# EAGLE design oak-rgb-driver-board (EAGLE 7.3.0)
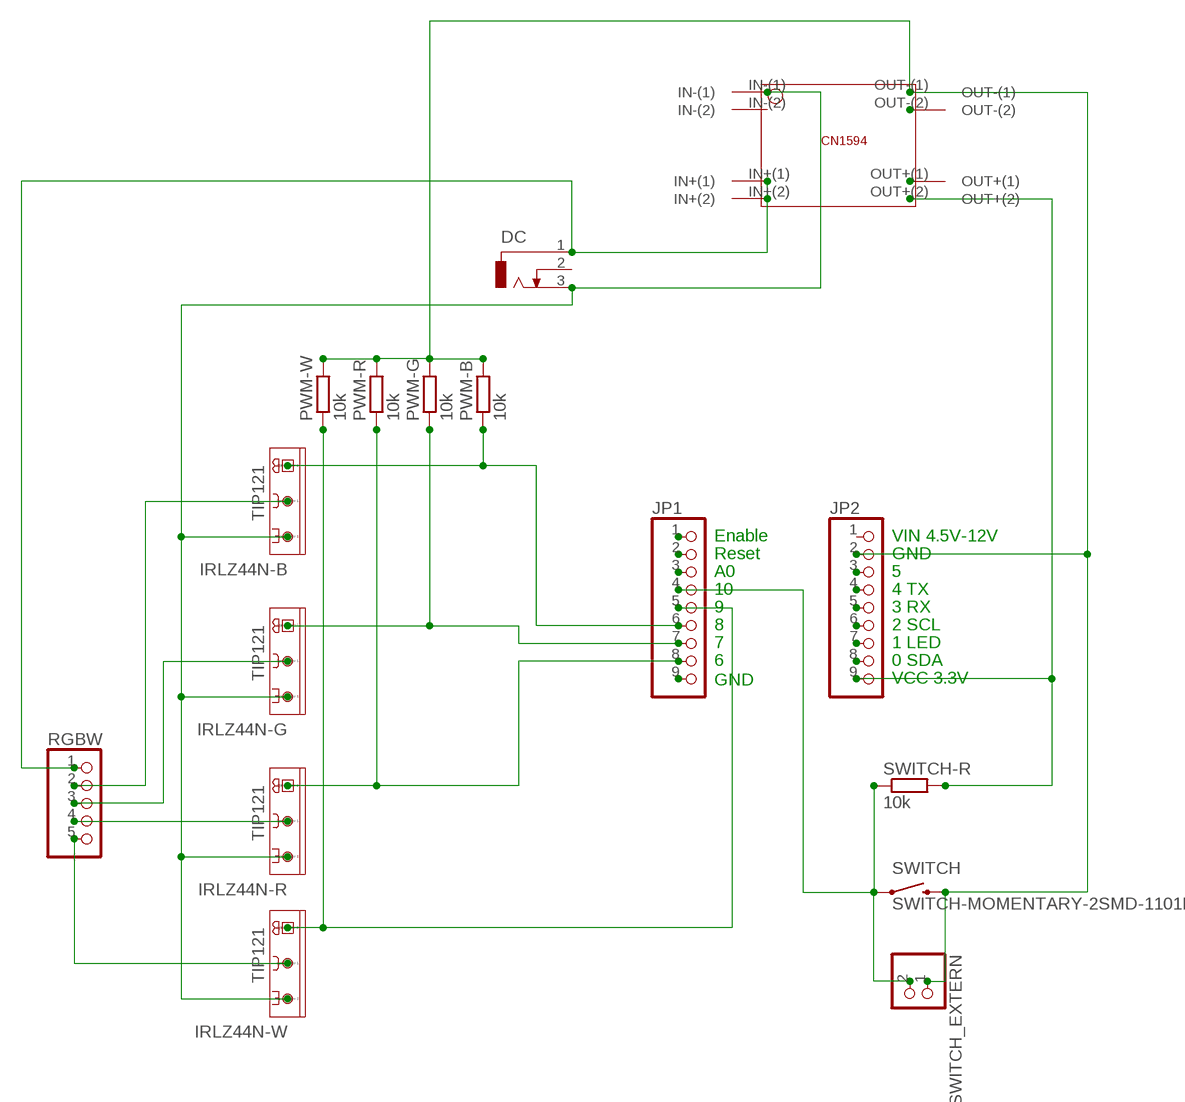
[diagram p0: schematic, sheet 1]

## Parts
DC  DCJ0202  [DCJ0202]
IRLZ44N-B  TIP121  [TO220AV]
IRLZ44N-G  TIP121  [TO220AV]
IRLZ44N-R  TIP121  [TO220AV]
IRLZ44N-W  TIP121  [TO220AV]
JP1  PINHD-1X9  [1X09]
JP2  PINHD-1X9  [1X09]
PWM-B  10k  R-EU_R0603  [R0603]
PWM-G  10k  R-EU_R0603  [R0603]
PWM-R  10k  R-EU_R0603  [R0603]
PWM-W  10k  R-EU_R0603  [R0603]
RGBW  PINHD-1X5  [1X05]
SWITCH  SWITCH-MOMENTARY-2SMD-1101NE  [TACTILE-SWITCH-1101NE]
SWITCH-R  10k  R-EU_R0603  [R0603]
SWITCH_EXTERN  PINHD-1X2  [1X02]
U$1  CN1594THROUGH-HOLE  [CN1594]

## Nets
B_DRIVE [12V]: IRLZ44N-B.C RGBW.2
G_DRIVE [12V]: IRLZ44N-G.C RGBW.3
GND [GND3.3]: JP2.2 PWM-B.2 PWM-G.2 PWM-R.2 PWM-W.2 SWITCH.2 SWITCH_EXTERN.1 U$1.OUT-(1)
GND_IN [GNDRGB]: DC.3 IRLZ44N-B.E IRLZ44N-G.E IRLZ44N-R.E IRLZ44N-W.E U$1.IN-(1)
N$3: JP1.9
N$7: U$1.OUT+(1)
N$9: U$1.OUT-(2)
N$12: JP1.3
N$16: JP1.2
N$17: JP1.1
N$19: JP2.8
N$20: JP2.7
N$21: JP2.6
N$22: JP2.5
N$23: JP2.4
N$24: JP2.3
P6_OUT [Signal]: IRLZ44N-R.B JP1.8 PWM-R.1
P7_OUT [Signal]: IRLZ44N-G.B JP1.7 PWM-G.1
P8_OUT [Signal]: IRLZ44N-B.B JP1.6 PWM-B.1
P9_OUT [Signal]: IRLZ44N-W.B JP1.5 PWM-W.1
P10_IN [Signal]: JP1.4 SWITCH-R.1 SWITCH.1 SWITCH_EXTERN.2
R_DRIVE [12V]: IRLZ44N-R.C RGBW.4
VCC_DC [12V]: DC.1 RGBW.1 U$1.IN+(1) U$1.IN+(2)
VCC_LOW [3.3V]: JP2.9 SWITCH-R.2 U$1.OUT+(2)
W_DRIVE [12V]: IRLZ44N-W.C RGBW.5
Unconnected: DC.2 JP2.1 U$1.IN-(2)

## Notes on the sheet
- Enable | VIN 4.5V-12V
- Reset | GND
- A0 | 5
- 10 | 4 TX
- 9 | 3 RX
- 8 | 2 SCL
- 7 | 1 LED
- 6 | 0 SDA
- GND | VCC 3.3V

## Library data of the parts
DC = con-jack:DCJ0202: DC POWER JACK Source: DCJ0202.pdf; OC_FARNELL: unknown; OC_NEWARK: unknown
IRLZ44N-B IRLZ44N-G IRLZ44N-R IRLZ44N-W = PAsystem:TIP121: TO-220
JP1 JP2 = pinhead:PINHD-1X9: PIN HEADER
PWM-B PWM-G PWM-R PWM-W SWITCH-R = rcl:R-EU_: RESISTOR, European symbol
RGBW = pinhead:PINHD-1X5: PIN HEADER
SWITCH = SparkFun-Electromechanical:SWITCH-MOMENTARY-2: Various NO switches- pushbuttons, reed, etc; PROD_ID: SWCH-00815
SWITCH_EXTERN = pinhead:PINHD-1X2: PIN HEADER
U$1 = CN1594_smd:CN1594

## Net classes
1 GNDRGB: width 1.27 mm
2 12V: width 1.27 mm
3 GND3.3: width 0.635 mm
4 Signal: width 0.381 mm
5 3.3V: width 0.635 mm

## Board
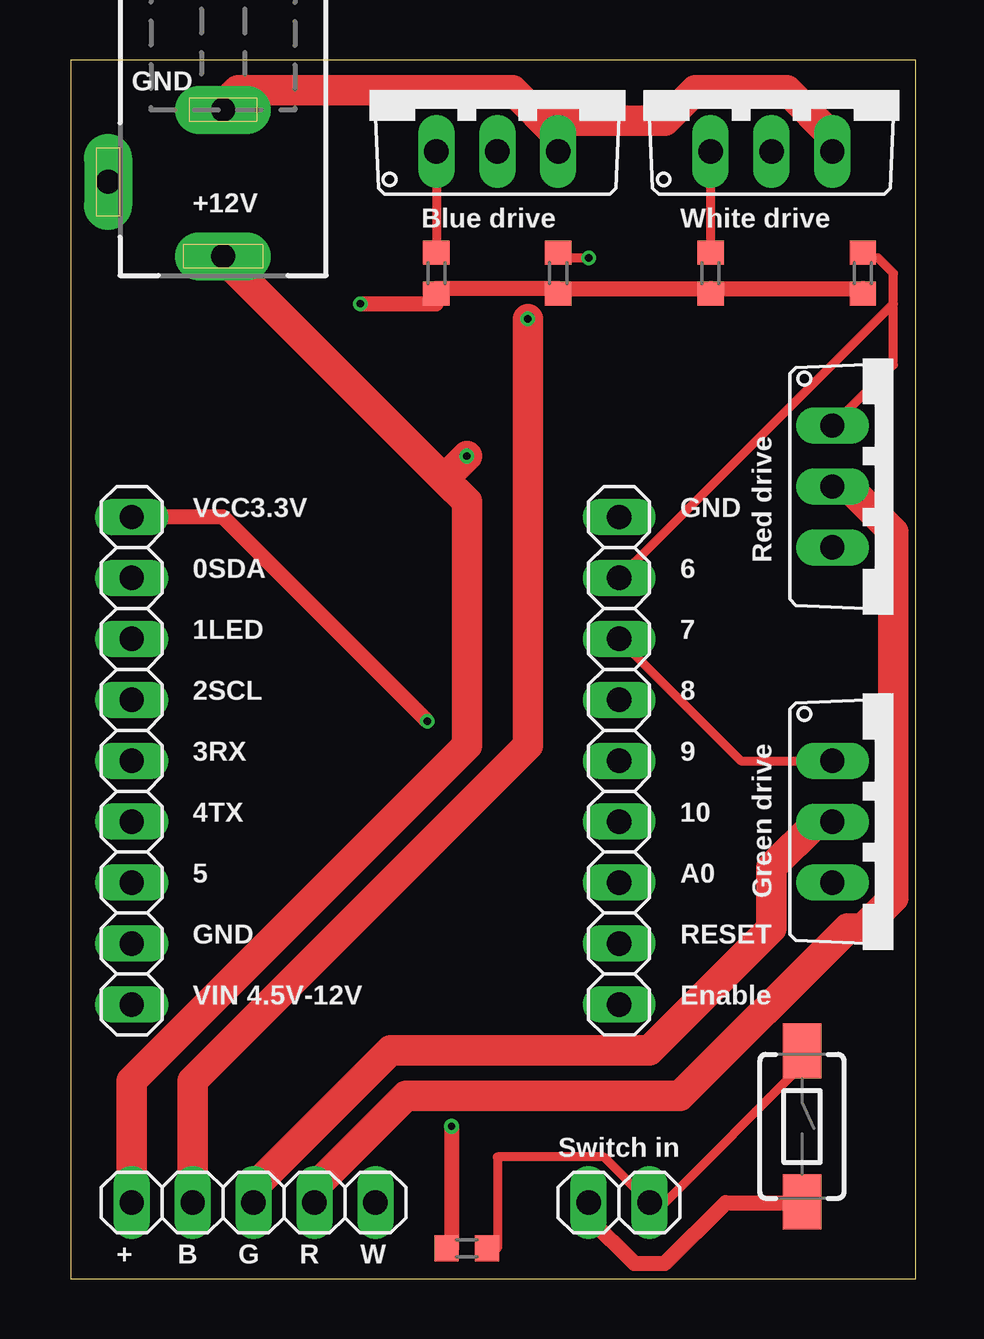
[diagram p1: board, top side]
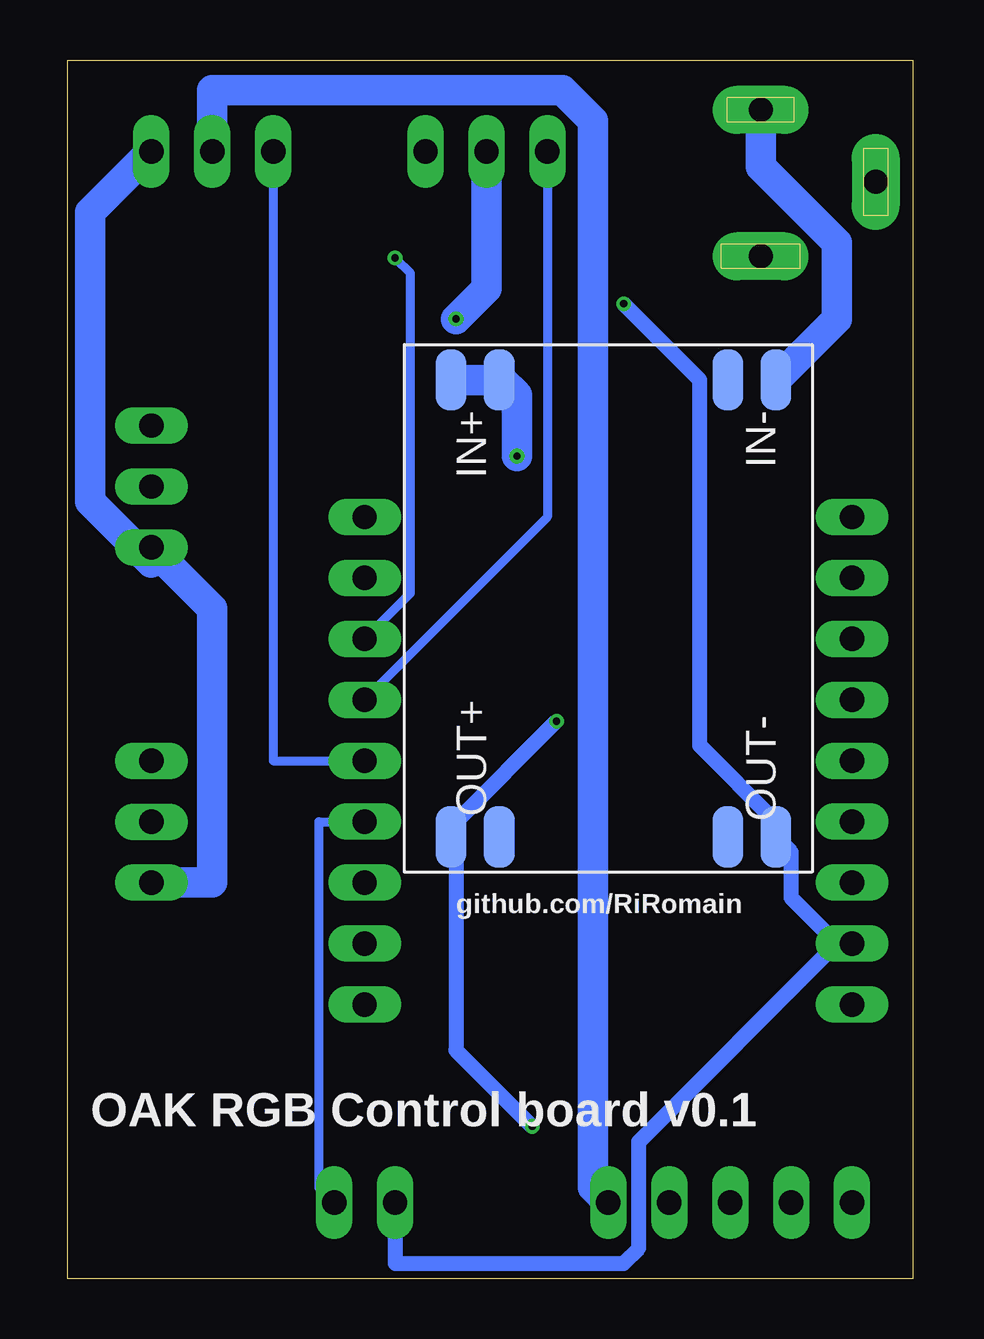
[diagram p2: board, bottom side, seen from below]

Size 35.23 x 50.79 mm. Coordinates in mm from the lower left corner, seen from the top.
Outline: 0,0 35.23,0 35.23,50.79 0,50.79 0,0
Copper layers (1*16): Top 0.035mm / dielectric 1.5mm / Bottom 0.035mm
Design rules "dirt_cheap_dirty_boards.v1 *": minimum track width 5mil, minimum drill 12mil, track to track 7mil, track to pad 7mil, pad to pad 7mil, via to via 7mil, smd to smd 0mil, copper to edge 10mil, drill to drill 10mil, minimum pad ring 10mil, minimum via ring 6mil, stop-mask expansion 2mil, vias tented up to drill 25mil, thermal gap 10mil

### Footprints (pad centres in the part's own frame; a part is rotated, then mirrored left to right if it is on the bottom)
DCJ0202 = drill 1 pad 2 long: 1 0,3.1; 2 4.8,0; 3 0,-3
TO220AV = drill 1.016 long: B -2.54,-2.54; C 0,-2.54; E 2.54,-2.54
1X09 = drill 1.016 long: 1 -10.16,0; 2 -7.62,0; 3 -5.08,0; 4 -2.54,0; 5 0,0; 6 2.54,0; 7 5.08,0; 8 7.62,0; 9 10.16,0
R0603 = smd 1 x 1.1: 1 -0.85,0; 2 0.85,0
1X05 = drill 1.016 long: 1 -5.08,0; 2 -2.54,0; 3 0,0; 4 2.54,0; 5 5.08,0
TACTILE-SWITCH-1101NE = smd 2.3 x 1.6: 1 -3.15,0; 2 3.15,0
1X02 = drill 1.016 long: 1 -1.27,0; 2 1.27,0
CN1594 = smd 2.54 x 1.27: IN+(1) -9.525,-4.547; IN+(2) -9.525,-6.553; IN-(1) -9.525,6.985; IN-(2) -9.525,4.978; OUT+(1) 9.525,-4.547; OUT+(2) 9.525,-6.553; OUT-(1) 9.525,6.985; OUT-(2) 9.525,4.978

### Placement (x,y rotation side)
DC  6.35,45.72 180 top
IRLZ44N-B  17.78,49.53 0 top
IRLZ44N-G  34.29,19.05 270 top
IRLZ44N-R  34.29,33.02 270 top
IRLZ44N-W  29.21,49.53 0 top
JP1  22.86,21.59 90 top
JP2  2.54,21.59 90 top
PWM-B  15.24,41.91 270 top
PWM-G  20.32,41.91 270 top
PWM-R  33.02,41.91 270 top
PWM-W  26.67,41.91 270 top
RGBW  7.62,3.17 0 top
SWITCH  30.48,6.35 270 top
SWITCH-R  16.51,1.27 180 top
SWITCH_EXTERN  22.86,3.17 0 top
U$1  12.7,27.94 270 bottom

### Tracks (layer width: path | path; a pad name or v marks a point on that pad's centre or on a via)
B_DRIVE  (via drill 0.3)
  Top 1.27: RGBW.2 5.08,8.26 19.05,22.23 v19.05,40
  Bottom 1.27: v19.05,40 17.78,41.28 IRLZ44N-B.C
G_DRIVE
  Top 1.27: RGBW.3 7.62,3.81 13.34,9.52 24.13,9.52 29.21,14.6 29.21,17.15 31.11,19.05 IRLZ44N-G.C
GND  (via drill 0.3)
  Top 0.635: 20.32,41.28 15.24,41.28 PWM-B.2 15.24,40.64 v12.06,40.64 | 20.32,41.28 26.67,41.28 | 20.32,41.28 PWM-G.2 | 26.67,41.28 33.02,41.28 PWM-R.2 | 26.67,41.28 PWM-W.2 | SWITCH_EXTERN.1 21.59,2.54 23.5,0.63 24.77,0.63 27.3,3.17 30.48,3.17 SWITCH.2
  Bottom 0.635: 3.17,13.97 5.08,15.88 5.08,17.78 U$1.OUT-(1) 5.71,19.05 8.89,22.23 8.89,37.47 v12.06,40.64 | 3.17,13.97 11.43,5.72 11.43,1.27 12.06,0.63 21.59,0.63 SWITCH_EXTERN.1 | 3.17,13.97 JP2.2
GND_IN
  Top 1.27: DC.3 6.35,48.89 6.99,49.53 18.41,49.53 20.32,47.62 IRLZ44N-B.E 20.32,48.26 24.77,48.26 26.04,49.53 29.84,49.53 31.75,47.62 IRLZ44N-W.E
  Bottom 1.27: U$1.IN-(1) 3.17,40 3.17,43.18 6.35,46.36 DC.3 | IRLZ44N-G.E 29.21,16.51 29.21,27.94 IRLZ44N-R.E 31.75,29.84 34.29,32.39 34.29,44.45 IRLZ44N-W.E
P6_OUT
  Top 0.381: 34.29,40.64 34.29,38.1 IRLZ44N-R.B | 34.29,40.64 34.29,41.91 33.66,42.55 33.02,42.55 PWM-R.1 | 34.29,40.64 JP1.8
P7_OUT  (via drill 0.3)
  Top 0.381: v21.59,42.55 20.32,42.55 PWM-G.1 | IRLZ44N-G.B 27.94,21.59 JP1.7
  Bottom 0.381: v21.59,42.55 20.95,41.91 20.95,28.58 JP1.7
P8_OUT
  Top 0.381: IRLZ44N-B.B PWM-B.1
  Bottom 0.381: JP1.6 15.24,31.75 IRLZ44N-B.B
P9_OUT
  Top 0.381: IRLZ44N-W.B PWM-W.1
  Bottom 0.381: JP1.5 26.67,21.59 IRLZ44N-W.B
P10_IN
  Top 0.381: SWITCH-R.1 17.78,1.27 17.78,5.08 22.23,5.08 SWITCH_EXTERN.2 24.77,3.17 30.48,8.89 SWITCH.1
  Bottom 0.381: JP1.4 24.77,19.05 24.77,3.81 SWITCH_EXTERN.2
R_DRIVE
  Top 1.27: RGBW.4 10.16,3.81 13.97,7.62 25.4,7.62 32.38,14.6 33.02,14.6 34.29,15.88 34.29,31.12 32.38,33.02 IRLZ44N-R.C
VCC_DC  (via drill 0.3)
  Top 1.27: RGBW.1 2.54,8.26 16.51,22.23 16.51,32.39 15.56,33.34 | 15.56,33.34 6.35,42.55 DC.1 | 15.56,33.34 v16.51,34.29
  Bottom 1.27: U$1.IN+(2) U$1.IN+(1) 17.14,37.47 16.51,36.83 v16.51,34.29
VCC_LOW  (via drill 0.3)
  Top 0.635: v15.88,6.35 15.88,1.27 SWITCH-R.2 | JP2.9 6.35,31.75 v14.86,23.24
  Bottom 0.635: v15.88,6.35 19.05,9.52 19.05,18.41 | v14.86,23.24 19.05,19.05 19.05,18.41 | 19.05,18.41 U$1.OUT+(2)
W_DRIVE
  Bottom 1.27: RGBW.5 13.34,3.81 13.34,48.26 14.61,49.53 29.21,49.53 IRLZ44N-W.C

### Text on the board
tPlace: GND | +12V | Blue drive | White drive | GND | Red drive | 0SDA | 6 | 1LED | 7 | 2SCL | 8 | 3RX | 9 | 4TX | 10 | 5 | A0 | Green drive | GND | RESET | VIN 4.5V-12V | Enable | Switch in | + | B | G | R | W
bPlace: github.com/RiRomain | OAK RGB Control board v0.1
tNames: VCC3.3V